# Altium schematic sheet PX4FMUv2.3_SCH.SchDoc
size A4
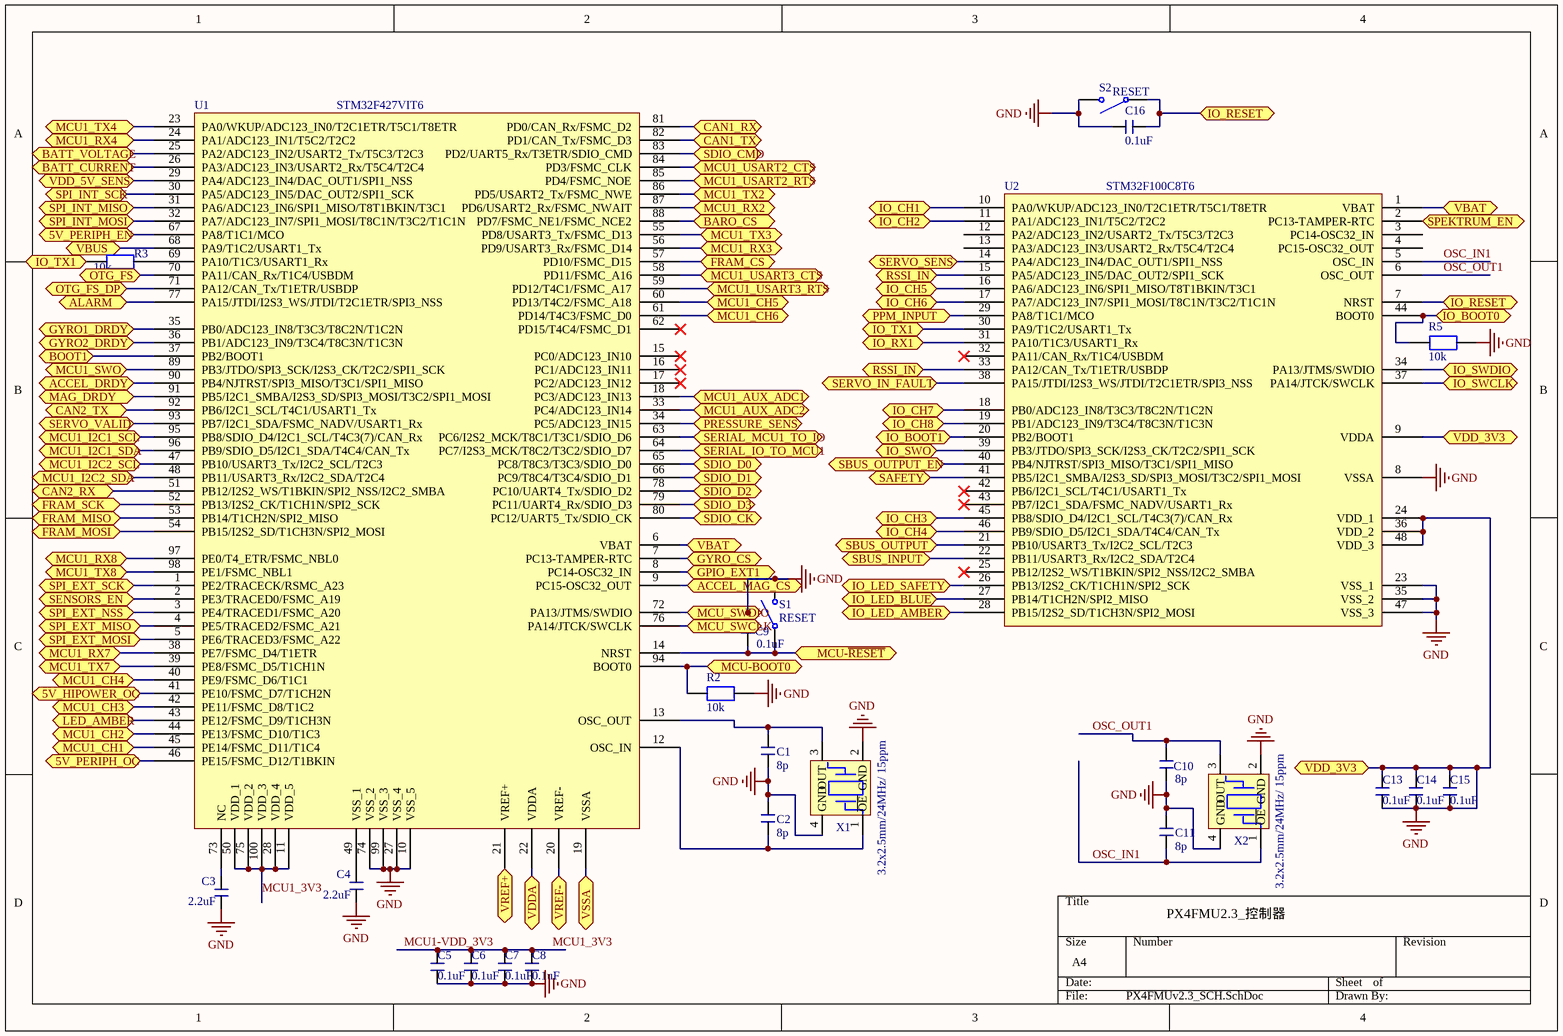
[diagram p0: PX4FMUv2.3_SCH.SchDoc]

## Parts
C1  8p  [C 0402]
C2  8p  [C 0402]
C3  2.2uF  [C 0603_L]
C4  2.2uF  [C 0603_L]
C5  0.1uF  [C 0402]
C6  0.1uF  [C 0402]
C7  0.1uF  [C 0402]
C8  0.1uF  [C 0402]
C9  0.1uF  [C 0402]
C10  8p  [C 0402]
C11  8p  [C 0402]
C13  0.1uF  [C 0402]
C14  0.1uF  [C 0402]
C15  0.1uF  [C 0402]
C16  0.1uF  [C 0402]
R2  10k  [0402R]
R3  10k  [0402R]
R5  10k  [0402R]
S1  RESET  [EVQP7J01K]
S2  RESET  [EVQP7J01K]
U1  STM32F427VIT6  [LQPF_100]
U2  STM32F100C8T6  [LQFP_48]
X1  3.2x2.5mm/24MHz/ 15ppm  [OSC 3225-4P]
X2  3.2x2.5mm/24MHz/ 15ppm  [OSC 3225-4P]

## Ports
5V_HIPOWER_OC (bidir), 5V_PERIPH_EN (bidir), 5V_PERIPH_OC (bidir), ACCEL_DRDY (bidir), ACCEL_MAG_CS (bidir), ALARM (bidir), BARO_CS (bidir), BATT_CURRENT (bidir), BATT_VOLTAGE (bidir), BOOT1 (bidir), CAN1_RX (bidir), CAN1_TX (bidir), CAN2_RX (bidir), CAN2_TX (bidir), FRAM_CS (bidir), FRAM_MISO (bidir), FRAM_MOSI (bidir), FRAM_SCK (bidir), GPIO_EXT1 (bidir), GYRO1_DRDY (bidir), GYRO2_DRDY (bidir), GYRO_CS (bidir), IO_BOOT0 (bidir), IO_BOOT1 (bidir), IO_CH1 (bidir), IO_CH2 (bidir), IO_CH3 (bidir), IO_CH4 (bidir), IO_CH5 (bidir), IO_CH6 (bidir), IO_CH7 (bidir), IO_CH8 (bidir), IO_LED_AMBER (bidir), IO_LED_BLUE (bidir), IO_LED_SAFETY (bidir), IO_RESET (bidir), IO_RX1 (bidir), IO_SWCLK (bidir), IO_SWDIO (bidir), IO_SWO (bidir), IO_TX1 (bidir), LED_AMBER (bidir), MAG_DRDY (bidir), MCU1_AUX_ADC1 (bidir), MCU1_AUX_ADC2 (bidir), MCU1_CH1 (bidir), MCU1_CH2 (bidir), MCU1_CH3 (bidir), MCU1_CH4 (bidir), MCU1_CH5 (bidir), MCU1_CH6 (bidir), MCU1_I2C1_SCL (bidir), MCU1_I2C1_SDA (bidir), MCU1_I2C2_SCL (bidir), MCU1_I2C2_SDA (bidir), MCU1_RX2 (bidir), MCU1_RX3 (bidir), MCU1_RX4 (bidir), MCU1_RX7 (bidir), MCU1_RX8 (bidir), MCU1_SWO (bidir), MCU1_TX2 (bidir), MCU1_TX3 (bidir), MCU1_TX4 (bidir), MCU1_TX7 (bidir), MCU1_TX8 (bidir), MCU1_USART2_CTS (bidir), MCU1_USART2_RTS (bidir), MCU1_USART3_CTS (bidir), MCU1_USART3_RTS (bidir), MCU-BOOT0 (bidir), MCU-~{RESET} (bidir), MCU_SWCLK (bidir), MCU_SWDIO (bidir), OTG_FS (bidir), OTG_FS_DP (bidir), PPM_INPUT (bidir), PRESSURE_SENS (bidir), RSSI_IN (bidir), SAFETY (bidir), SBUS_INPUT (bidir), SBUS_OUTPUT (bidir), SBUS_OUTPUT_EN (bidir), SDIO_CK (bidir), SDIO_CMD (bidir), SDIO_D0 (bidir), SDIO_D1 (bidir), SDIO_D2 (bidir), SDIO_D3 (bidir), SENSORS_EN (bidir), SERIAL_IO_TO_MCU1 (bidir), SERIAL_MCU1_TO_IO (bidir), SERVO_IN_FAULT (bidir), SERVO_SENS (bidir), SERVO_VALID (bidir), SPEKTRUM_EN (bidir), SPI_EXT_MISO (bidir), SPI_EXT_MOSI (bidir), SPI_EXT_NSS (bidir), SPI_EXT_SCK (bidir), SPI_INT_MISO (bidir), SPI_INT_MOSI (bidir), SPI_INT_SCK (bidir), VBAT (bidir), VBUS (bidir), VDD_3V3 (bidir), VDD_5V_SENS (bidir), VDDA (bidir), VREF+ (bidir), VREF- (bidir), VSSA (bidir)

## Nets
GND: C1.2 C2.1 C3.2 C4.2 C5.2 C6.2 C7.2 C8.2 C9.2 C10.2 C11.1 C13.1 C13.2 C14.1 C14.2 C15.1 C15.2 C16.2 R2.1 R5.1 S1.2 S2.2 U1.10(VSS_5) U1.27(VSS_4) U1.74(VSS_2) U1.99(VSS_3) U2.8(VSSA) U2.9(VDDA) U2.23(VSS_1) U2.24(VDD_1) U2.35(VSS_2) U2.36(VDD_2) U2.47(VSS_3) U2.48(VDD_3) X1.2(GND) X1.4(GND) X2.2(GND) X2.4(GND) ; port VDD_3V3
5V_HIPOWER_OC: U1.41(PE10/FSMC_D7/T1CH2N) ; port 5V_HIPOWER_OC
5V_PERIPH_EN: U1.67(PA8/T1C1/MCO) ; port 5V_PERIPH_EN
5V_PERIPH_OC: U1.46(PE15/FSMC_D12/T1BKIN) ; port 5V_PERIPH_OC
ACCEL_DRDY: U1.90(PB4/NJTRST/SPI3_MISO/T3C1/SPI1_MISO) ; port ACCEL_DRDY
ACCEL_MAG_CS: U1.9(PC15-OSC32_OUT) ; port ACCEL_MAG_CS
ALARM: U1.77(PA15/JTDI/I2S3_WS/JTDI/T2C1ETR/SPI3_NSS) ; port ALARM
BARO_CS: U1.88(PD7/FSMC_NE1/FSMC_NCE2) ; port BARO_CS
BATT_CURRENT: U1.26(PA3/ADC123_IN3/USART2_Rx/T5C4/T2C4) ; port BATT_CURRENT
BATT_VOLTAGE: U1.25(PA2/ADC123_IN2/USART2_Tx/T5C3/T2C3) ; port BATT_VOLTAGE
BOOT1: U1.37(PB2/BOOT1) ; port BOOT1
CAN1_RX: U1.81(PD0/CAN_Rx/FSMC_D2) ; port CAN1_RX
CAN1_TX: U1.82(PD1/CAN_Tx/FSMC_D3) ; port CAN1_TX
CAN2_RX: U1.51(PB12/I2S2_WS/T1BKIN/SPI2_NSS/I2C2_SMBA) ; port CAN2_RX
CAN2_TX: U1.92(PB6/I2C1_SCL/T4C1/USART1_Tx) ; port CAN2_TX
FRAM_CS: U1.57(PD10/FSMC_D15) ; port FRAM_CS
FRAM_MISO: U1.53(PB14/T1CH2N/SPI2_MISO) ; port FRAM_MISO
FRAM_MOSI: U1.54(PB15/I2S2_SD/T1CH3N/SPI2_MOSI) ; port FRAM_MOSI
FRAM_SCK: U1.52(PB13/I2S2_CK/T1CH1N/SPI2_SCK) ; port FRAM_SCK
GPIO_EXT1: U1.8(PC14-OSC32_IN) ; port GPIO_EXT1
GYRO1_DRDY: U1.35(PB0/ADC123_IN8/T3C3/T8C2N/T1C2N) ; port GYRO1_DRDY
GYRO2_DRDY: U1.36(PB1/ADC123_IN9/T3C4/T8C3N/T1C3N) ; port GYRO2_DRDY
GYRO_CS: U1.7(PC13-TAMPER-RTC) ; port GYRO_CS
IO_BOOT0: R5.2 U2.44(BOOT0) ; port IO_BOOT0
IO_BOOT1: U2.20(PB2/BOOT1) ; port IO_BOOT1
IO_CH1: U2.10(PA0/WKUP/ADC123_IN0/T2C1ETR/T5C1/T8ETR) ; port IO_CH1
IO_CH2: U2.11(PA1/ADC123_IN1/T5C2/T2C2) ; port IO_CH2
IO_CH3: U2.45(PB8/SDIO_D4/I2C1_SCL/T4C3(7)/CAN_Rx) ; port IO_CH3
IO_CH4: U2.46(PB9/SDIO_D5/I2C1_SDA/T4C4/CAN_Tx) ; port IO_CH4
IO_CH5: U2.16(PA6/ADC123_IN6/SPI1_MISO/T8T1BKIN/T3C1) ; port IO_CH5
IO_CH6: U2.17(PA7/ADC123_IN7/SPI1_MOSI/T8C1N/T3C2/T1C1N) ; port IO_CH6
IO_CH7: U2.18(PB0/ADC123_IN8/T3C3/T8C2N/T1C2N) ; port IO_CH7
IO_CH8: U2.19(PB1/ADC123_IN9/T3C4/T8C3N/T1C3N) ; port IO_CH8
IO_LED_AMBER: U2.28(PB15/I2S2_SD/T1CH3N/SPI2_MOSI) ; port IO_LED_AMBER
IO_LED_BLUE: U2.27(PB14/T1CH2N/SPI2_MISO) ; port IO_LED_BLUE
IO_LED_SAFETY: U2.26(PB13/I2S2_CK/T1CH1N/SPI2_SCK) ; port IO_LED_SAFETY
IO_RESET: C16.1 S2.1 U2.7(NRST) ; port IO_RESET
IO_RX1: U2.31(PA10/T1C3/USART1_Rx) ; port IO_RX1
IO_SWCLK: U2.37(PA14/JTCK/SWCLK) ; port IO_SWCLK
IO_SWDIO: U2.34(PA13/JTMS/SWDIO) ; port IO_SWDIO
IO_SWO: U2.39(PB3/JTDO/SPI3_SCK/I2S3_CK/T2C2/SPI1_SCK) ; port IO_SWO
IO_TX1: R3.1 U2.30(PA9/T1C2/USART1_Tx) ; port IO_TX1
LED_AMBER: U1.43(PE12/FSMC_D9/T1CH3N) ; port LED_AMBER
MAG_DRDY: U1.91(PB5/I2C1_SMBA/I2S3_SD/SPI3_MOSI/T3C2/SPI1_MOSI) ; port MAG_DRDY
MCU1-VDD_3V3: C5.1 C6.1 C7.1 C8.1 U1.11(VDD_5) U1.28(VDD_4) U1.50(VDD_1) U1.75(VDD_2) U1.100(VDD_3)  [also labelled MCU1_3V3]
MCU1_AUX_ADC1: U1.18(PC3/ADC123_IN13) ; port MCU1_AUX_ADC1
MCU1_AUX_ADC2: U1.33(PC4/ADC123_IN14) ; port MCU1_AUX_ADC2
MCU1_CH1: U1.45(PE14/FSMC_D11/T1C4) ; port MCU1_CH1
MCU1_CH2: U1.44(PE13/FSMC_D10/T1C3) ; port MCU1_CH2
MCU1_CH3: U1.42(PE11/FSMC_D8/T1C2) ; port MCU1_CH3
MCU1_CH4: U1.40(PE9/FSMC_D6/T1C1) ; port MCU1_CH4
MCU1_CH5: U1.60(PD13/T4C2/FSMC_A18) ; port MCU1_CH5
MCU1_CH6: U1.61(PD14/T4C3/FSMC_D0) ; port MCU1_CH6
MCU1_I2C1_SCL: U1.95(PB8/SDIO_D4/I2C1_SCL/T4C3(7)/CAN_Rx) ; port MCU1_I2C1_SCL
MCU1_I2C1_SDA: U1.96(PB9/SDIO_D5/I2C1_SDA/T4C4/CAN_Tx) ; port MCU1_I2C1_SDA
MCU1_I2C2_SCL: U1.47(PB10/USART3_Tx/I2C2_SCL/T2C3) ; port MCU1_I2C2_SCL
MCU1_I2C2_SDA: U1.48(PB11/USART3_Rx/I2C2_SDA/T2C4) ; port MCU1_I2C2_SDA
MCU1_RX2: U1.87(PD6/USART2_Rx/FSMC_NWAIT) ; port MCU1_RX2
MCU1_RX3: U1.56(PD9/USART3_Rx/FSMC_D14) ; port MCU1_RX3
MCU1_RX4: U1.24(PA1/ADC123_IN1/T5C2/T2C2) ; port MCU1_RX4
MCU1_RX7: U1.38(PE7/FSMC_D4/T1ETR) ; port MCU1_RX7
MCU1_RX8: U1.97(PE0/T4_ETR/FSMC_NBL0) ; port MCU1_RX8
MCU1_SWO: U1.89(PB3/JTDO/SPI3_SCK/I2S3_CK/T2C2/SPI1_SCK) ; port MCU1_SWO
MCU1_TX2: U1.86(PD5/USART2_Tx/FSMC_NWE) ; port MCU1_TX2
MCU1_TX3: U1.55(PD8/USART3_Tx/FSMC_D13) ; port MCU1_TX3
MCU1_TX4: U1.23(PA0/WKUP/ADC123_IN0/T2C1ETR/T5C1/T8ETR) ; port MCU1_TX4
MCU1_TX7: U1.39(PE8/FSMC_D5/T1CH1N) ; port MCU1_TX7
MCU1_TX8: U1.98(PE1/FSMC_NBL1) ; port MCU1_TX8
MCU1_USART2_CTS: U1.84(PD3/FSMC_CLK) ; port MCU1_USART2_CTS
MCU1_USART2_RTS: U1.85(PD4/FSMC_NOE) ; port MCU1_USART2_RTS
MCU1_USART3_CTS: U1.58(PD11/FSMC_A16) ; port MCU1_USART3_CTS
MCU1_USART3_RTS: U1.59(PD12/T4C1/FSMC_A17) ; port MCU1_USART3_RTS
MCU-BOOT0: R2.2 U1.94(BOOT0) ; port MCU-BOOT0
MCU-~{RESET}: C9.1 S1.1 U1.14(NRST) ; port MCU-~{RESET}
MCU_SWCLK: U1.76(PA14/JTCK/SWCLK) ; port MCU_SWCLK
MCU_SWDIO: U1.72(PA13/JTMS/SWDIO) ; port MCU_SWDIO
OSC_IN1: C11.2 U2.5(OSC_IN) X2.1(~{OE})
OSC_OUT1: C10.1 U2.6(OSC_OUT) X2.3(OUT)
OTG_FS: U1.70(PA11/CAN_Rx/T1C4/USBDM) ; port OTG_FS
OTG_FS_DP: U1.71(PA12/CAN_Tx/T1ETR/USBDP) ; port OTG_FS_DP
PPM_INPUT: U2.29(PA8/T1C1/MCO) ; port PPM_INPUT
PRESSURE_SENS: U1.34(PC5/ADC123_IN15) ; port PRESSURE_SENS
RSSI_IN: U2.15(PA5/ADC123_IN5/DAC_OUT2/SPI1_SCK) U2.33(PA12/CAN_Tx/T1ETR/USBDP) ; port RSSI_IN
SAFETY: U2.41(PB5/I2C1_SMBA/I2S3_SD/SPI3_MOSI/T3C2/SPI1_MOSI) ; port SAFETY
SBUS_INPUT: U2.22(PB11/USART3_Rx/I2C2_SDA/T2C4) ; port SBUS_INPUT
SBUS_OUTPUT: U2.21(PB10/USART3_Tx/I2C2_SCL/T2C3) ; port SBUS_OUTPUT
SBUS_OUTPUT_EN: U2.40(PB4/NJTRST/SPI3_MISO/T3C1/SPI1_MISO) ; port SBUS_OUTPUT_EN
SDIO_CK: U1.80(PC12/UART5_Tx/SDIO_CK) ; port SDIO_CK
SDIO_CMD: U1.83(PD2/UART5_Rx/T3ETR/SDIO_CMD) ; port SDIO_CMD
SDIO_D0: U1.65(PC8/T8C3/T3C3/SDIO_D0) ; port SDIO_D0
SDIO_D1: U1.66(PC9/T8C4/T3C4/SDIO_D1) ; port SDIO_D1
SDIO_D2: U1.78(PC10/UART4_Tx/SDIO_D2) ; port SDIO_D2
SDIO_D3: U1.79(PC11/UART4_Rx/SDIO_D3) ; port SDIO_D3
SENSORS_EN: U1.2(PE3/TRACED0/FSMC_A19) ; port SENSORS_EN
SERIAL_IO_TO_MCU1: U1.64(PC7/I2S3_MCK/T8C2/T3C2/SDIO_D7) ; port SERIAL_IO_TO_MCU1
SERIAL_MCU1_TO_IO: U1.63(PC6/I2S2_MCK/T8C1/T3C1/SDIO_D6) ; port SERIAL_MCU1_TO_IO
SERVO_IN_FAULT: U2.38(PA15/JTDI/I2S3_WS/JTDI/T2C1ETR/SPI3_NSS) ; port SERVO_IN_FAULT
SERVO_SENS: U2.14(PA4/ADC123_IN4/DAC_OUT1/SPI1_NSS) ; port SERVO_SENS
SERVO_VALID: U1.93(PB7/I2C1_SDA/FSMC_NADV/USART1_Rx) ; port SERVO_VALID
SPEKTRUM_EN: U2.2(PC13-TAMPER-RTC) ; port SPEKTRUM_EN
SPI_EXT_MISO: U1.4(PE5/TRACED2/FSMC_A21) ; port SPI_EXT_MISO
SPI_EXT_MOSI: U1.5(PE6/TRACED3/FSMC_A22) ; port SPI_EXT_MOSI
SPI_EXT_NSS: U1.3(PE4/TRACED1/FSMC_A20) ; port SPI_EXT_NSS
SPI_EXT_SCK: U1.1(PE2/TRACECK/RSMC_A23) ; port SPI_EXT_SCK
SPI_INT_MISO: U1.31(PA6/ADC123_IN6/SPI1_MISO/T8T1BKIN/T3C1) ; port SPI_INT_MISO
SPI_INT_MOSI: U1.32(PA7/ADC123_IN7/SPI1_MOSI/T8C1N/T3C2/T1C1N) ; port SPI_INT_MOSI
SPI_INT_SCK: U1.30(PA5/ADC123_IN5/DAC_OUT2/SPI1_SCK) ; port SPI_INT_SCK
VBAT: U1.6(VBAT) U2.1(VBAT) ; port VBAT
VBUS: U1.68(PA9/T1C2/USART1_Tx) ; port VBUS
VDD_5V_SENS: U1.29(PA4/ADC123_IN4/DAC_OUT1/SPI1_NSS) ; port VDD_5V_SENS
VDDA: U1.22(VDDA) ; port VDDA
VREF+: U1.21(VREF+) ; port VREF+
VREF-: U1.20(VREF-) ; port VREF-
VSSA: U1.19(VSSA) ; port VSSA
NetC1_1: C1.1 U1.13(OSC_OUT) X1.3(OUT)
NetC2_2: C2.2 U1.12(OSC_IN) X1.1(~{OE})
NetC3_1: C3.1 U1.73(NC)
NetC4_1: C4.1 U1.49(VSS_1)
NetR3_2: R3.2 U1.69(PA10/T1C3/USART1_Rx)

Not connected (* = marked no-connect by the designer): U1 15(PC0/ADC123_IN10)* 16(PC1/ADC123_IN11)* 17(PC2/ADC123_IN12)* 62(PD15/T4C4/FSMC_D1)*; U2 3(PC14-OSC32_IN) 4(PC15-OSC32_OUT) 12(PA2/ADC123_IN2/USART2_Tx/T5C3/T2C3) 13(PA3/ADC123_IN3/USART2_Rx/T5C4/T2C4) 25(PB12/I2S2_WS/T1BKIN/SPI2_NSS/I2C2_SMBA)* 32(PA11/CAN_Rx/T1C4/USBDM)* 42(PB6/I2C1_SCL/T4C1/USART1_Tx)* 43(PB7/I2C1_SDA/FSMC_NADV/USART1_Rx)*

## Notes on the sheet
- PX4FMU2.3_控制器

## Library data of the parts
C1 C2 C5-C11 C13-C16 = CAP_0402
C3 C4 = CAP_0603
R2 R3 R5 = Res_0402
S1 S2 = SWITCH-MOMENTARY-2
X1 X2 = OSCILLATOR